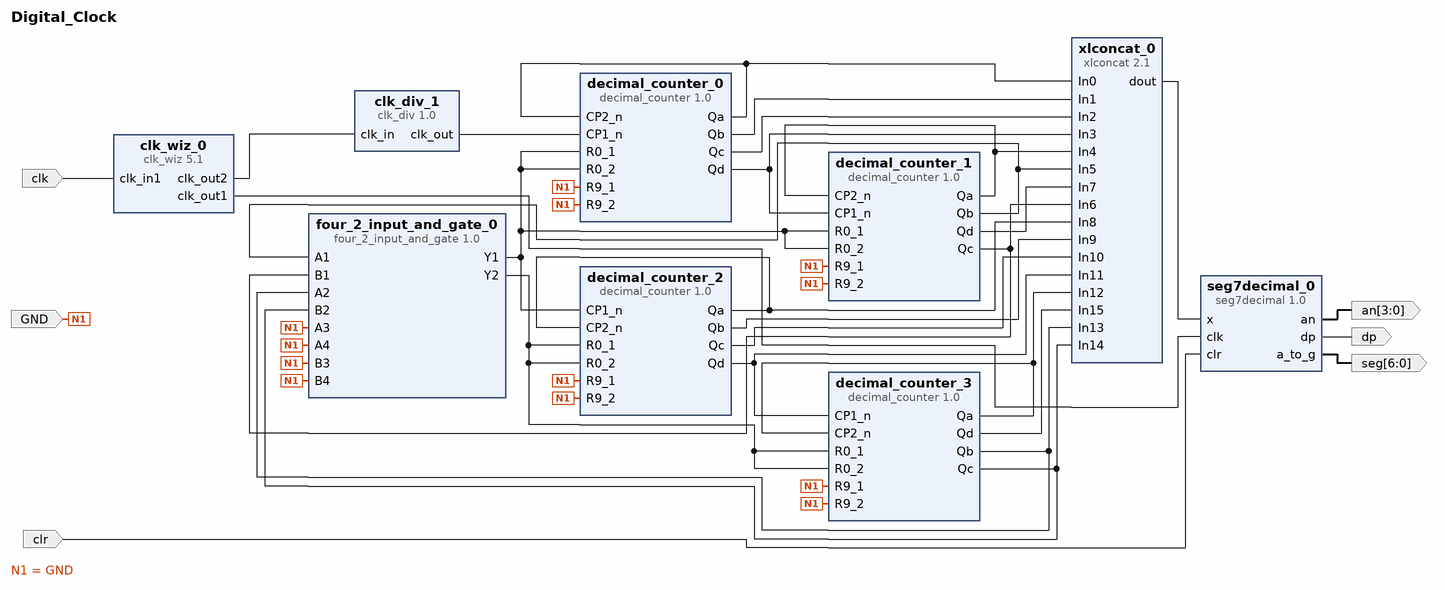
[diagram p0: block diagram of the top level]
# Vivado block design Digital_Clock, Vivado 2014.4
create_bd_design Digital_Clock

create_bd_port -dir I GND
create_bd_port -dir I clk
create_bd_port -dir I clr
create_bd_port -dir O -from 6 -to 0 seg
create_bd_port -dir O -from 3 -to 0 an
create_bd_port -dir O dp

create_bd_cell -type ip -vlnv xilinx.com:xup:clk_div:1.0 clk_div_1
set_property -dict {CONFIG.N 99999999} [get_bd_cells clk_div_1]
create_bd_cell -type ip -vlnv xilinx.com:ip:clk_wiz:5.1 clk_wiz_0
set_property -dict [list \
  CONFIG.PRIMITIVE PLL \
  CONFIG.CLKOUT2_USED true \
  CONFIG.USE_LOCKED false \
  CONFIG.USE_RESET false \
] [get_bd_cells clk_wiz_0]
create_bd_cell -type ip -vlnv xilinx.com:xup:decimal_counter:1.0 decimal_counter_0
create_bd_cell -type ip -vlnv xilinx.com:xup:decimal_counter:1.0 decimal_counter_1
create_bd_cell -type ip -vlnv xilinx.com:xup:decimal_counter:1.0 decimal_counter_2
create_bd_cell -type ip -vlnv xilinx.com:xup:decimal_counter:1.0 decimal_counter_3
create_bd_cell -type ip -vlnv xilinx.com:XUP:four_2_input_and_gate:1.0 four_2_input_and_gate_0
create_bd_cell -type ip -vlnv xilinx.com:xup:seg7decimal:1.0 seg7decimal_0
create_bd_cell -type ip -vlnv xilinx.com:ip:xlconcat:2.1 xlconcat_0
set_property -dict {CONFIG.NUM_PORTS 16} [get_bd_cells xlconcat_0]

# ---- connections ----

connect_bd_net [get_bd_ports GND] \
  [get_bd_pins decimal_counter_0/R9_1] [get_bd_pins decimal_counter_0/R9_2] [get_bd_pins decimal_counter_1/R9_1] \
  [get_bd_pins decimal_counter_1/R9_2] [get_bd_pins decimal_counter_2/R9_1] [get_bd_pins decimal_counter_2/R9_2] \
  [get_bd_pins decimal_counter_3/R9_1] [get_bd_pins decimal_counter_3/R9_2] [get_bd_pins four_2_input_and_gate_0/A3] \
  [get_bd_pins four_2_input_and_gate_0/A4] [get_bd_pins four_2_input_and_gate_0/B3] [get_bd_pins four_2_input_and_gate_0/B4]
connect_bd_net [get_bd_ports clk] [get_bd_pins clk_wiz_0/clk_in1]
connect_bd_net [get_bd_pins clk_div_1/clk_out] [get_bd_pins decimal_counter_0/CP1_n]
connect_bd_net [get_bd_pins clk_wiz_0/clk_out1] [get_bd_pins seg7decimal_0/clk]
connect_bd_net [get_bd_pins clk_wiz_0/clk_out2] [get_bd_pins clk_div_1/clk_in]
connect_bd_net [get_bd_ports clr] [get_bd_pins seg7decimal_0/clr]
connect_bd_net [get_bd_pins decimal_counter_0/Qa] [get_bd_pins decimal_counter_0/CP2_n] [get_bd_pins xlconcat_0/In0]
connect_bd_net [get_bd_pins decimal_counter_0/Qb] [get_bd_pins xlconcat_0/In1]
connect_bd_net [get_bd_pins decimal_counter_0/Qc] [get_bd_pins xlconcat_0/In2]
connect_bd_net [get_bd_pins decimal_counter_0/Qd] [get_bd_pins decimal_counter_1/CP1_n] [get_bd_pins xlconcat_0/In3]
connect_bd_net [get_bd_pins decimal_counter_1/Qa] [get_bd_pins decimal_counter_1/CP2_n] [get_bd_pins xlconcat_0/In4]
connect_bd_net [get_bd_pins decimal_counter_1/Qb] [get_bd_pins four_2_input_and_gate_0/A1] [get_bd_pins xlconcat_0/In5]
connect_bd_net [get_bd_pins decimal_counter_1/Qc] [get_bd_pins four_2_input_and_gate_0/B1] [get_bd_pins xlconcat_0/In6]
connect_bd_net [get_bd_pins decimal_counter_1/Qd] [get_bd_pins xlconcat_0/In7]
connect_bd_net [get_bd_pins decimal_counter_2/Qa] [get_bd_pins decimal_counter_2/CP2_n] [get_bd_pins xlconcat_0/In8]
connect_bd_net [get_bd_pins decimal_counter_2/Qb] [get_bd_pins xlconcat_0/In9]
connect_bd_net [get_bd_pins decimal_counter_2/Qc] [get_bd_pins xlconcat_0/In10]
connect_bd_net [get_bd_pins decimal_counter_2/Qd] [get_bd_pins decimal_counter_3/CP1_n] [get_bd_pins xlconcat_0/In11]
connect_bd_net [get_bd_pins decimal_counter_3/Qa] [get_bd_pins decimal_counter_3/CP2_n] [get_bd_pins xlconcat_0/In12]
connect_bd_net [get_bd_pins decimal_counter_3/Qb] [get_bd_pins four_2_input_and_gate_0/A2] [get_bd_pins xlconcat_0/In13]
connect_bd_net [get_bd_pins decimal_counter_3/Qc] [get_bd_pins four_2_input_and_gate_0/B2] [get_bd_pins xlconcat_0/In14]
connect_bd_net [get_bd_pins decimal_counter_3/Qd] [get_bd_pins xlconcat_0/In15]
connect_bd_net [get_bd_pins four_2_input_and_gate_0/Y1] \
  [get_bd_pins decimal_counter_0/R0_1] [get_bd_pins decimal_counter_0/R0_2] [get_bd_pins decimal_counter_1/R0_1] \
  [get_bd_pins decimal_counter_1/R0_2] [get_bd_pins decimal_counter_2/CP1_n]
connect_bd_net [get_bd_pins four_2_input_and_gate_0/Y2] \
  [get_bd_pins decimal_counter_2/R0_1] [get_bd_pins decimal_counter_2/R0_2] [get_bd_pins decimal_counter_3/R0_1] \
  [get_bd_pins decimal_counter_3/R0_2]
connect_bd_net [get_bd_pins seg7decimal_0/a_to_g] [get_bd_ports seg]
connect_bd_net [get_bd_pins seg7decimal_0/an] [get_bd_ports an]
connect_bd_net [get_bd_pins seg7decimal_0/dp] [get_bd_ports dp]
connect_bd_net [get_bd_pins xlconcat_0/dout] [get_bd_pins seg7decimal_0/x]

validate_bd_design
save_bd_design
